# EAGLE design HMC6343 Breakout (EAGLE 6.5.0)
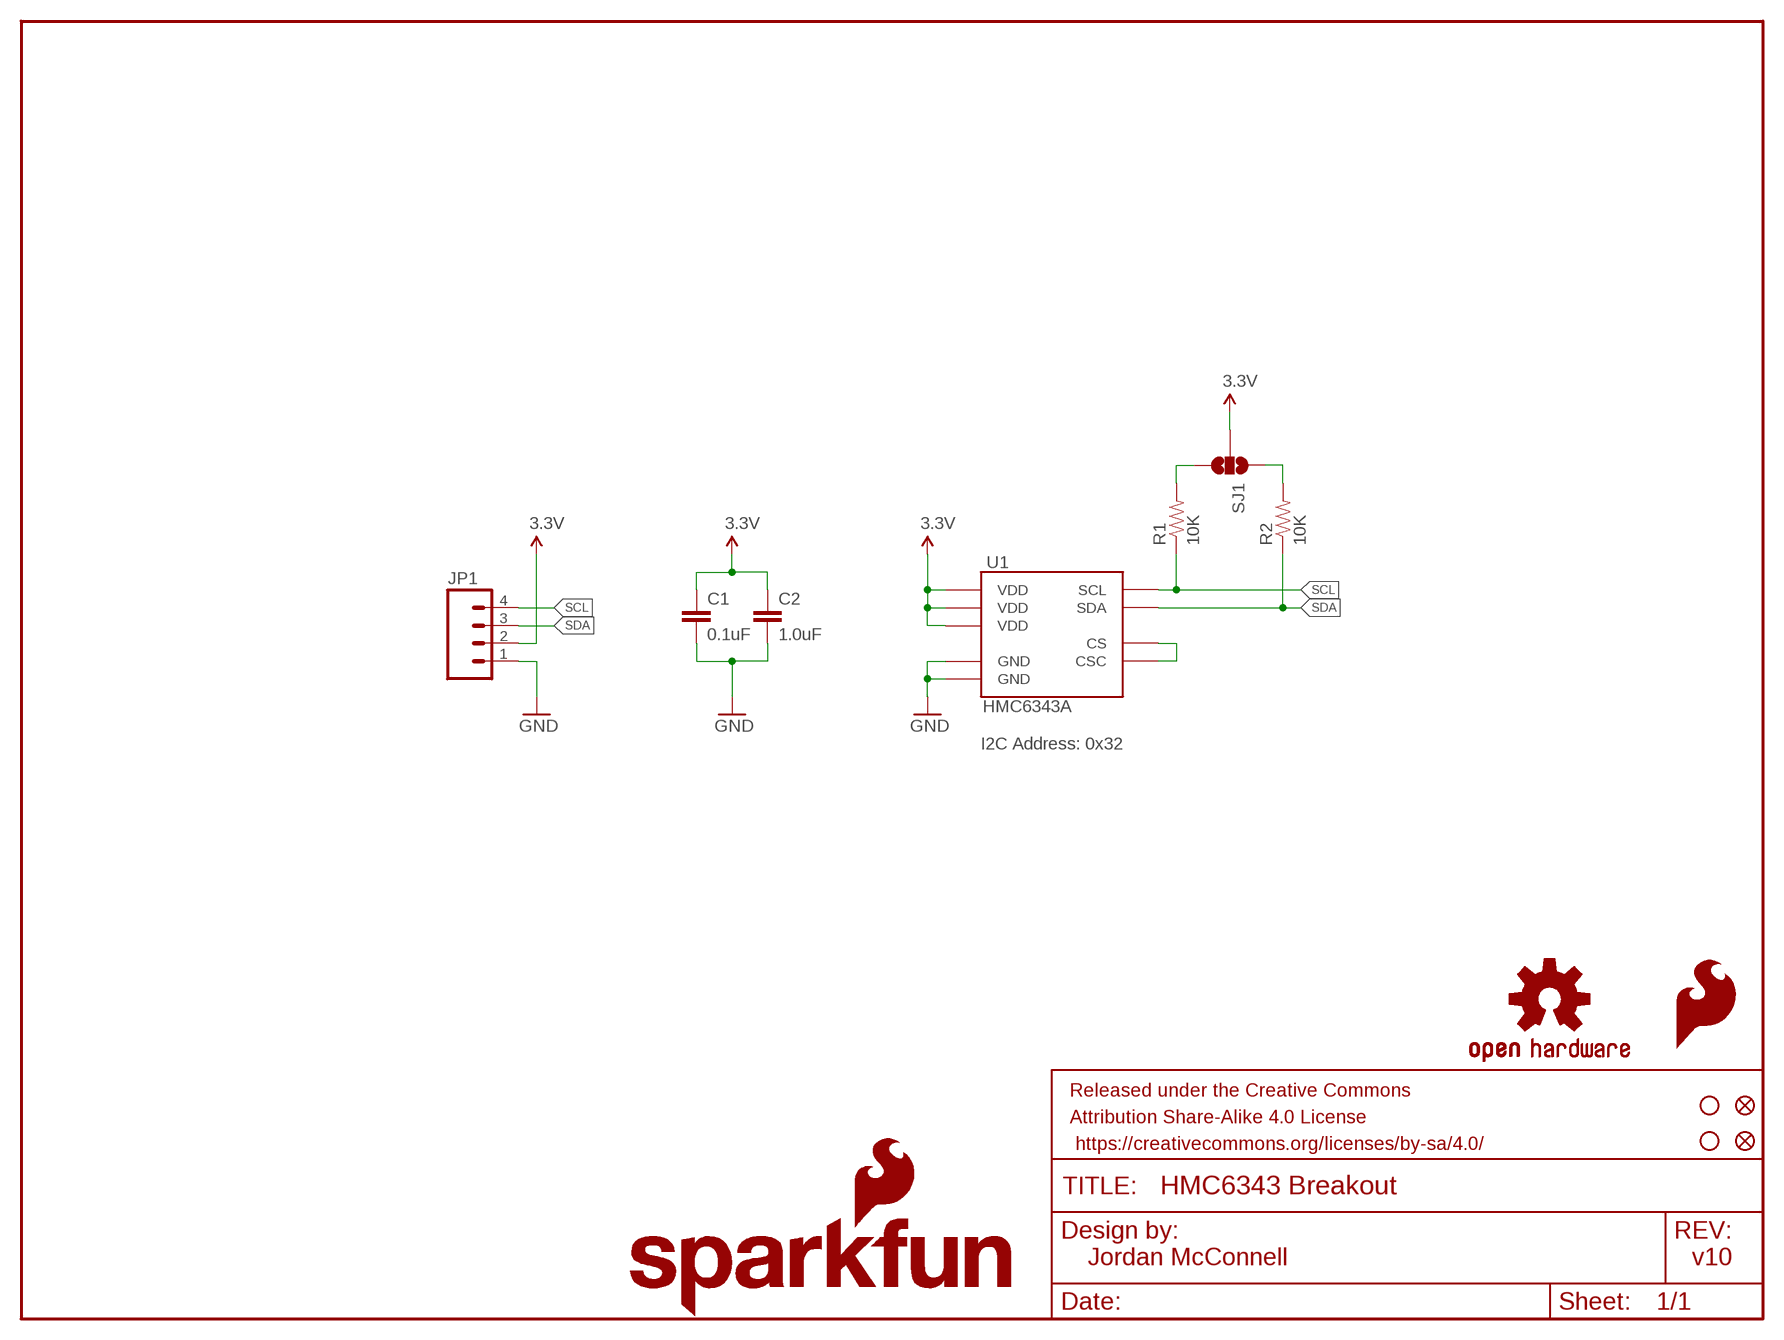
[diagram p0: schematic, sheet 1]

## Parts
C1  0.1uF  0.1UF-25V(+80/-20%)(0603)  [0603-CAP]
C2  1.0uF  1.0UF-16V-10%(0603)  [0603-CAP]
FID1  FIDUCIAL1X2  [FIDUCIAL-1X2]
FID2  FIDUCIAL1X2  [FIDUCIAL-1X2]
FRAME1  FRAME-LETTER  [CREATIVE_COMMONS]
JP1  M04PTH  [1X04]
LOGO1  SFE_LOGO_FLAME.1_INCH  [SFE_LOGO_FLAME_.1]
LOGO2  SFE_LOGO_NAME_FLAME.1_INCH  [SFE_LOGO_NAME_FLAME_.1]
LOGO3  OSHW-LOGOS  [OSHW-LOGO-S]
R1  10K  10KOHM1/10W1%(0603)0603  [0603-RES]
R2  10K  10KOHM1/10W1%(0603)0603  [0603-RES]
SJ1  SOLDERJUMPER_2WAYPASTE1&2&3  [SJ_3_PASTE1&2&3]
STANDOFF1  STAND-OFF  [STAND-OFF]
STANDOFF2  STAND-OFF  [STAND-OFF]
U1  HMC6343A  [LCC36]

## Nets
3.3V: C1.1 C2.1 JP1.2 SJ1.2 U1.3(VDD) U1.11(VDD) U1.21(VDD)
GND: C1.2 C2.2 JP1.1 U1.25(GND) U1.29(GND)
N$1: U1.22(CS) U1.35(CSC)
N$4: R1.2 SJ1.3
N$5: R2.2 SJ1.1
SCL: JP1.4 R1.1 U1.32(SCL)
SDA: JP1.3 R2.1 U1.36(SDA)

## Notes on the sheet
- I2C Address: 0x32
- Jordan McConnell | v10

## Library data of the parts
C1 = SparkFun-Capacitors:0.1UF-25V(+80/-20%)(0603): CAP-00810 Ceramic Standard decoupling cap; PROD_ID: CAP-00810
C2 = SparkFun-Capacitors:1.0UF-16V-10%(0603): CAP-00868; PROD_ID: CAP-00868
FID1 FID2 = SparkFun-Aesthetics:FIDUCIAL: Fiducial Alignment Points Various fiducial points for machine vision alignment.
FRAME1 = SparkFun-Aesthetics:FRAME-LETTER: Schematic Frame Standard 8.5x11 US Letter frame
JP1 = SparkFun-Connectors:M04: Header 4 Standard 4-pin 0.1" header. Use with straight break away headers (SKU : PRT-00116), right angle break away headers (PRT-00553), swiss pins (PRT-00743), machine pins (PRT-00117), and female headers (PRT-00115). Molex polarized connector foot print use with SKU : PRT-08231 with associated crimp pins and housings. 1MM SMD Version SKU: PRT-10208
LOGO1 = SparkFun-Aesthetics:SFE_LOGO_FLAME: SFE Logo, flame only This is the SparkFun flame logo. The logo on the schematic will always be the same size; the package variant is the height of the flame. Default layer for the logo on the board is tSilk.
LOGO2 = SparkFun-Aesthetics:SFE_LOGO_NAME_FLAME: SFE Logo, name and flame This is the SparkFun full logo. The logo on the schematic will always be the same size; the package variant is the height of the flame part of the logo. Default layer for the logo on the board is tSilk.
LOGO3 = SparkFun-Aesthetics:OSHW-LOGO: Open Source Hardware Logo This logo indicates the piece of hardware it is found on incorporates a OSHW license and/or adheres to the definition of open source hardware found here: http://freedomdefined.org/OSHW
R1 R2 = SparkFun-Resistors:10KOHM1/10W1%(0603): RES-00824; PROD_ID: RES-00824
SJ1 = SparkFun-Passives:SOLDERJUMPER_2WAY: Solder Jumper 2 way solder jumper
STANDOFF1 STANDOFF2 = SparkFun-Electromechanical:STAND-OFF: #4 Stand Off This is the mechanical footprint for a #4 phillips button head screw. Use the keepout ring to avoid running the screw head into surrounding components. SKU : PRT-00447
U1 = SparkFun-Sensors:HMC6343: Honeywell compass IC with tilt compensation, SEN-08656

## Board
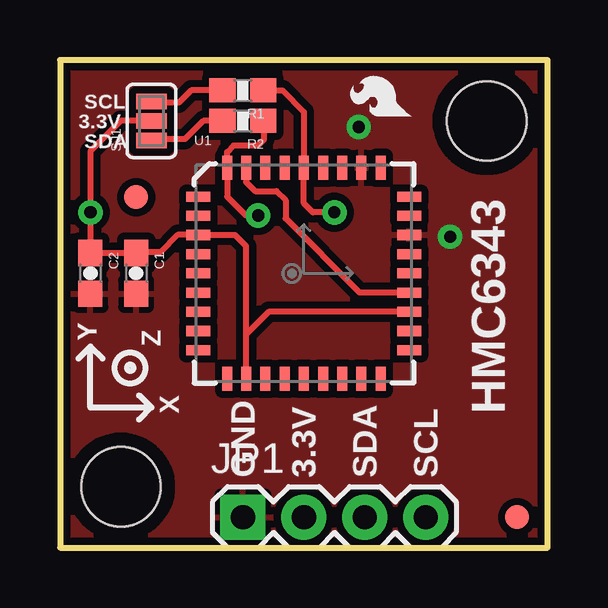
[diagram p1: board, top side]
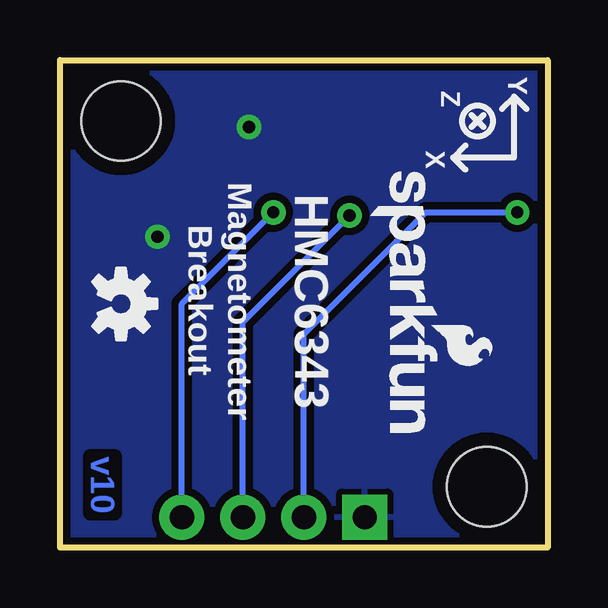
[diagram p2: board, bottom side, seen from below]

Size 20.32 x 20.32 mm. Coordinates in mm from the lower left corner, seen from the top.
Outline: 0,0 20.32,0 20.32,20.32 0,20.32 0,0
Copper layers (1*16): Top 0.035mm / dielectric 1.5mm / Bottom 0.035mm
Design rules "SparkFun": minimum track width 8mil, minimum drill 20mil, track to track 8mil, track to pad 8mil, pad to pad 8mil, via to via 8mil, smd to smd 8mil, copper to edge 8mil, drill to drill 8mil, minimum pad ring 12mil, minimum via ring 10mil, stop-mask expansion 4mil, vias tented up to drill 20mil, thermal gap 10mil

### Footprints (pad centres in the part's own frame; a part is rotated, then mirrored left to right if it is on the bottom)
0603-CAP = smd 1.1 x 1: 1 -0.85,0; 2 0.85,0
FIDUCIAL-1X2 = smd 1 x 1: 1 0,0
1X04 = drill 1.016 pad 1.88 square: 1 0,0 | drill 1.016 pad 1.88: 2 2.54,0; 3 5.08,0; 4 7.62,0
0603-RES = smd 1.1 x 1: 1 -0.85,0; 2 0.85,0
SJ_3_PASTE1&2&3 = smd 0.635 x 1.27: 1 -0.813,0; 2 0,0; 3 0.813,0
STAND-OFF = hole 3.302: 0,0
LCC36 = smd 1 x 0.42: 1 -4.4,3.2; 2 -4.4,2.4; 3 -4.4,1.6; 4 -4.4,0.8; 5 -4.4,0; 6 -4.4,-0.8; 7 -4.4,-1.6; 8 -4.4,-2.4; 9 -4.4,-3.2; 19 4.4,-3.2; 20 4.4,-2.4; 21 4.4,-1.6; 22 4.4,-0.8; 23 4.4,0; 24 4.4,0.8; 25 4.4,1.6; 26 4.4,2.4; 27 4.4,3.2 | smd 0.42 x 1: 10 -3.2,-4.4; 11 -2.4,-4.4; 12 -1.6,-4.4; 13 -0.8,-4.4; 14 0,-4.4; 15 0.8,-4.4; 16 1.6,-4.4; 17 2.4,-4.4; 18 3.2,-4.4; 28 3.2,4.4; 29 2.4,4.4; 30 1.6,4.4; 31 0.8,4.4; 32 0,4.4; 33 -0.8,4.4; 34 -1.6,4.4; 35 -2.4,4.4; 36 -3.2,4.4

### Placement (x,y rotation side)
C1  3.17,11.43 270 top
C2  1.27,11.43 270 top
FID1  19.05,1.27 0 top
FID2  3.17,14.61 0 top
FRAME1  -10.16,-15.24 0 top  (outside the outline)
JP1  7.62,1.27 0 top
LOGO1  14.99,17.65 90 top
LOGO2  7.49,16.13 270 bottom
LOGO3  17.78,10.16 270 bottom
R1  7.62,19.05 180 top
R2  7.62,17.78 180 top
SJ1  3.81,17.78 90 top
STANDOFF1  17.78,17.78 0 top
STANDOFF2  2.54,2.54 0 top
U1  10.16,11.43 0 top

### Tracks (layer width: path | path; a pad name or v marks a point on that pad's centre or on a via)
3.3V  (via drill 0.51)
  Top 0.254: 7.75,7.02 U1.11 7.76,8.89 | 7.76,8.89 7.76,12.56 7.49,12.83 7.29,13.03 U1.3 4.9,13.03 4.19,12.32 3.21,12.32 C1.1 C2.1 v1.27,13.97 1.27,16.51 2.54,17.78 SJ1.2 | U1.21 8.7,9.83 7.76,8.89
  Bottom 0.254: JP1.2 10.16,8.89 5.08,13.97 v1.27,13.97
GND  (via drill 0.51)
  other vias: 12.45,17.53 16.26,12.95
  pour Bottom (isolate 0.305): 0,20.32 20.32,20.32 20.32,0 0,0
  pour Top (isolate 0.305): 0,0 0,20.32 20.32,20.32 20.32,0
N$1
  Top 0.254: U1.35 7.76,15.23 8.13,14.86 9.02,14.86 9.4,14.48 9.4,13.72 12.45,10.67 12.48,10.63 U1.22
N$4
  Top 0.254: R1.2 5.46,19.05 4.95,18.54 3.86,18.54 SJ1.3
N$5
  Top 0.254: R2.2 5.97,17.78 5.21,17.02 3.86,17.02 SJ1.1
SCL  (via drill 0.51)
  Top 0.254: R1.1 9.27,19.05 10.16,18.16 U1.32 10.16,14.35 10.54,13.97 v11.43,13.97
  Bottom 0.254: JP1.4 15.24,10.16 v11.43,13.97
SDA  (via drill 0.51)
  Top 0.254: R2.1 8.51,17.74 8.51,17.02 8.26,16.76 7.24,16.76 6.96,16.48 U1.36 6.96,14.63 7.11,14.48 7.75,13.84 v8.26,13.84
  Bottom 0.254: JP1.3 12.7,9.4 v8.26,13.84

### Text on the board
Bottom: v10
tPlace: SCL | 3.3V | SDA | Y | Z | X | HMC6343 | GND | 3.3V | SDA | SCL
bPlace: Y | Z | X | HMC6343 | Magnetometer | Breakout